# Altium schematic sheet LPC1768_0.SchDoc: LPC1768
size 298 x 212 mm; Date: 02.08.2016 15:40:20; SheetNumber: 1
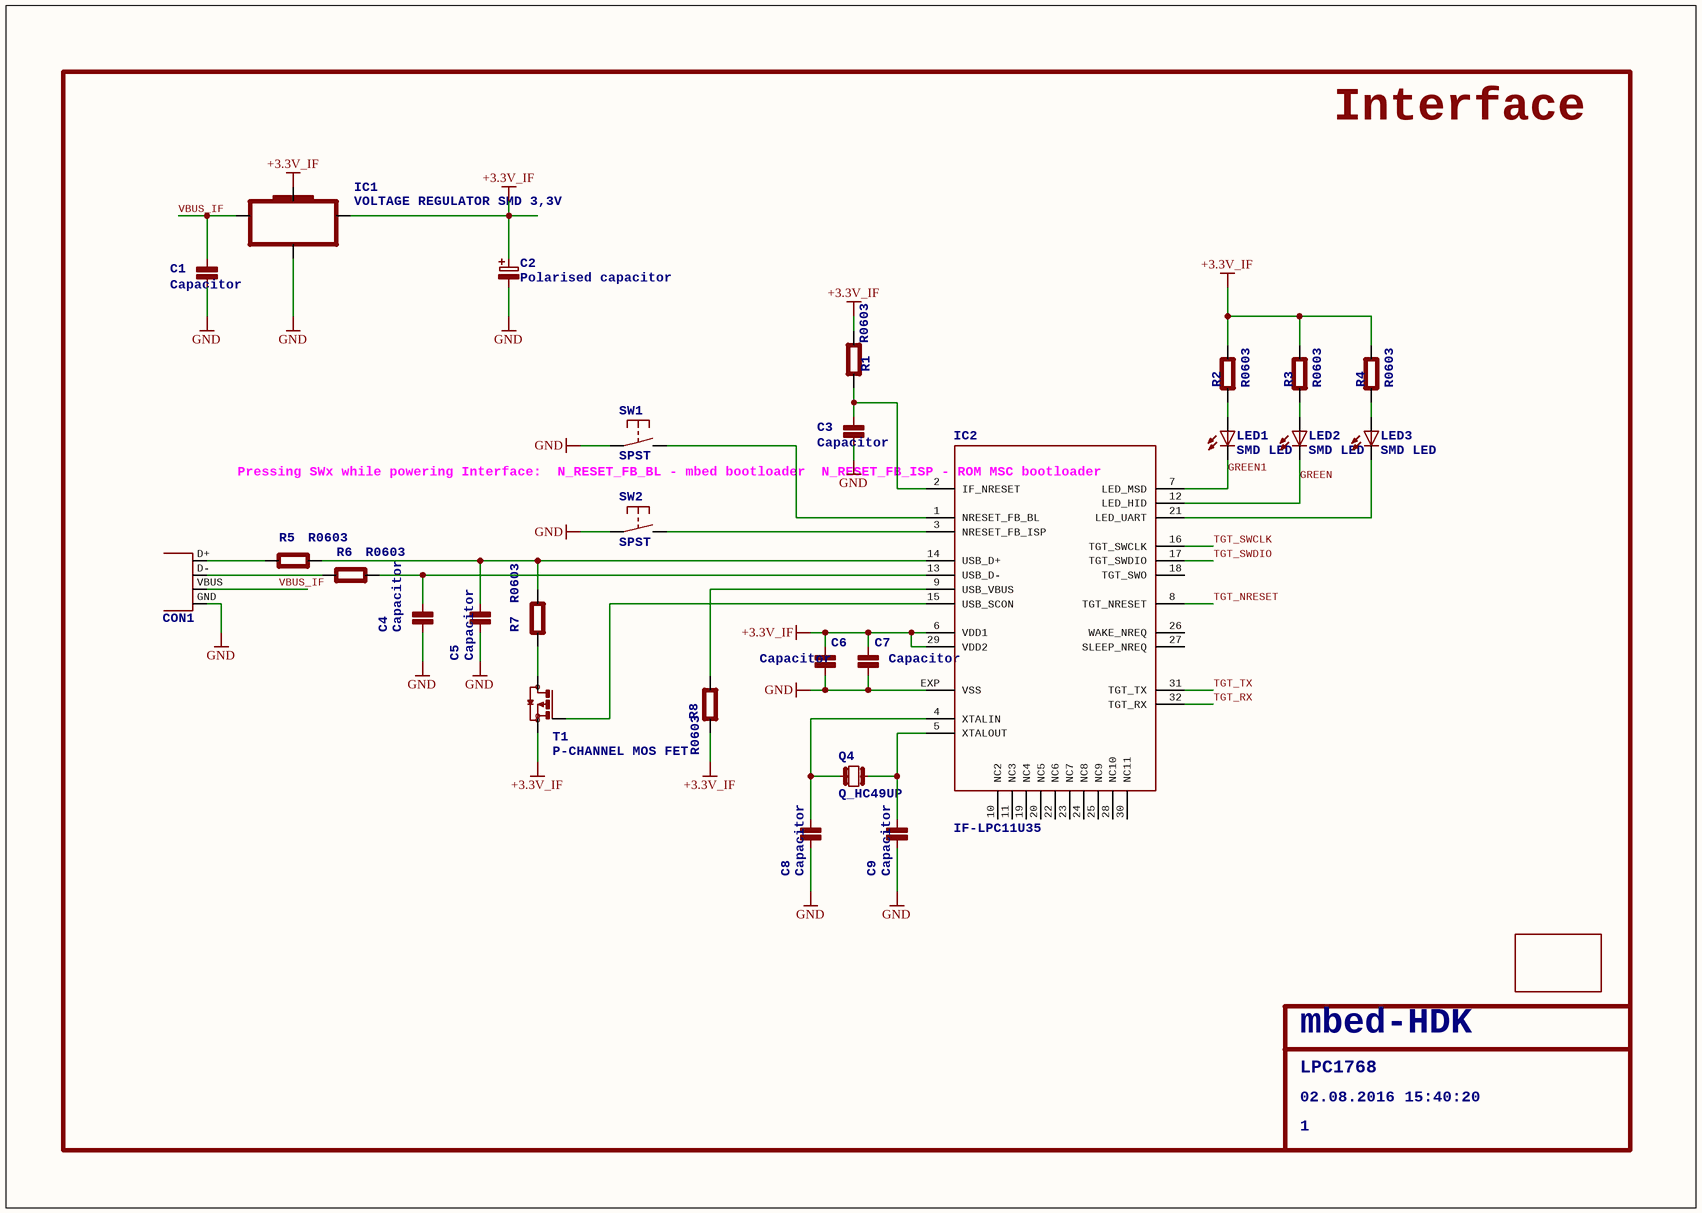
[diagram p0: LPC1768_0.SchDoc]

## Parts
C1  Capacitor  [0603]
C2  Polarised capacitor  [CASE-B]
C3  Capacitor  [0603]
C4  Capacitor  [0603]
C5  Capacitor  [0603]
C6  Capacitor  [0603]
C7  Capacitor  [0603]
C8  Capacitor  [0603]
C9  Capacitor  [0603]
CON1  USB Connectors  [USB-MB-S]  (value not drawn)
IC1  VOLTAGE REGULATOR SMD 3,3V  [SOT223]
IC2  IF-LPC11U35  [HVQFN33]
LED1  SMD LED  [CHIPLED_0603]
LED2  SMD LED  [CHIPLED_0603]
LED3  SMD LED  [CHIPLED_0603]
Q4  Q_HC49UP  [HC49UP]
R1  R0603  [0603]
R2  R0603  [0603]
R3  R0603  [0603]
R4  R0603  [0603]
R5  R0603  [0603]
R6  R0603  [0603]
R7  R0603  [0603]
R8  R0603  [0603]
SS1  MBED-ENABLED-LOGOMEDIUM  [MBED-ENABLED-LOGO-500X500-MIL]  (value not drawn)
SW1  SPST  [DTSM-32S-B]
SW2  SPST  [DTSM-32S-B]
T1  P-CHANNEL MOS FET  [SOT23]

## Nets
+3.3V_IF: C2.1 C6.1(P$1) C7.1(P$1) IC1.2(OUT) IC1.4(K) IC2.6(VDD1) IC2.29(VDD2) R1.2(P$2) R2.1(P$1) R3.1(P$1) R4.1(P$1) R8.2(P$2) T1.2(S)
GND: C1.2(P$2) C2.2 C3.2(P$2) C4.2(P$2) C5.2(P$2) C6.2(P$2) C7.2(P$2) C8.2(P$2) C9.2(P$2) CON1.GND IC1.1(GND) IC2.EXP(VSS) SW1.P$1(P) SW2.P$1(P)
GREEN: IC2.12(LED_HID) LED2.C
GREEN1: IC2.7(LED_MSD) LED1.C
TGT_NRESET: IC2.8(TGT_NRESET)
TGT_RX: IC2.32(TGT_RX)
TGT_SWCLK: IC2.16(TGT_SWCLK)
TGT_SWDIO: IC2.17(TGT_SWDIO)
TGT_TX: IC2.31(TGT_TX)
VBUS_IF: C1.1(P$1) CON1.VBUS IC1.3(IN)
NetC3_1: C3.1(P$1) IC2.2(IF_NRESET) R1.1(P$1)
NetC4_1: C4.1(P$1) IC2.13(USB_D-) R6.2(P$2)
NetC5_1: C5.1(P$1) IC2.14(USB_D+) R5.2(P$2) R7.2(P$2)
NetC8_1: C8.1(P$1) IC2.4(XTALIN) Q4.1
NetC9_1: C9.1(P$1) IC2.5(XTALOUT) Q4.2
NetCON1_D+: CON1.D+ R5.1(P$1)
NetCON1_D-: CON1.D- R6.1(P$1)
NetIC2_1: IC2.1(NRESET_FB_BL) SW1.P$2(S)
NetIC2_3: IC2.3(NRESET_FB_ISP) SW2.P$2(S)
NetIC2_9: IC2.9(USB_VBUS) R8.1(P$1)
NetIC2_15: IC2.15(USB_SCON) T1.1(G)
NetIC2_21: IC2.21(LED_UART) LED3.C
NetLED1_A: LED1.A R2.2(P$2)
NetLED2_A: LED2.A R3.2(P$2)
NetLED3_A: LED3.A R4.2(P$2)
NetR7_1: R7.1(P$1) T1.3(D)

Not connected (* = marked no-connect by the designer): IC2 10(NC2) 11(NC3) 18(TGT_SWO) 19(NC4) 20(NC5) 22(NC6) 23(NC7) 24(NC8) 25(NC9) 26(WAKE_NREQ) 27(SLEEP_NREQ) 28(NC10) 30(NC11)

## Notes on the sheet
- Interface
- (near IC2) Pressing SWx while powering Interface:
  N_RESET_FB_BL - mbed bootloader
  N_RESET_FB_ISP - ROM MSC bootloader
- LPC1768
- mbed-HDK
- 02.08.2016 15:40:20
- 1

## Library data of the parts
C1 C3-C9 = C0603
C2 = C-POLB
CON1 = USB-MB-S
IC1 = LD1117S33
LED1-LED3 = LED0603
T1 = BSS84